# Altium project iMX6 Rex Development Baseboard V1I1.PrjPcb (part 1 of 5)
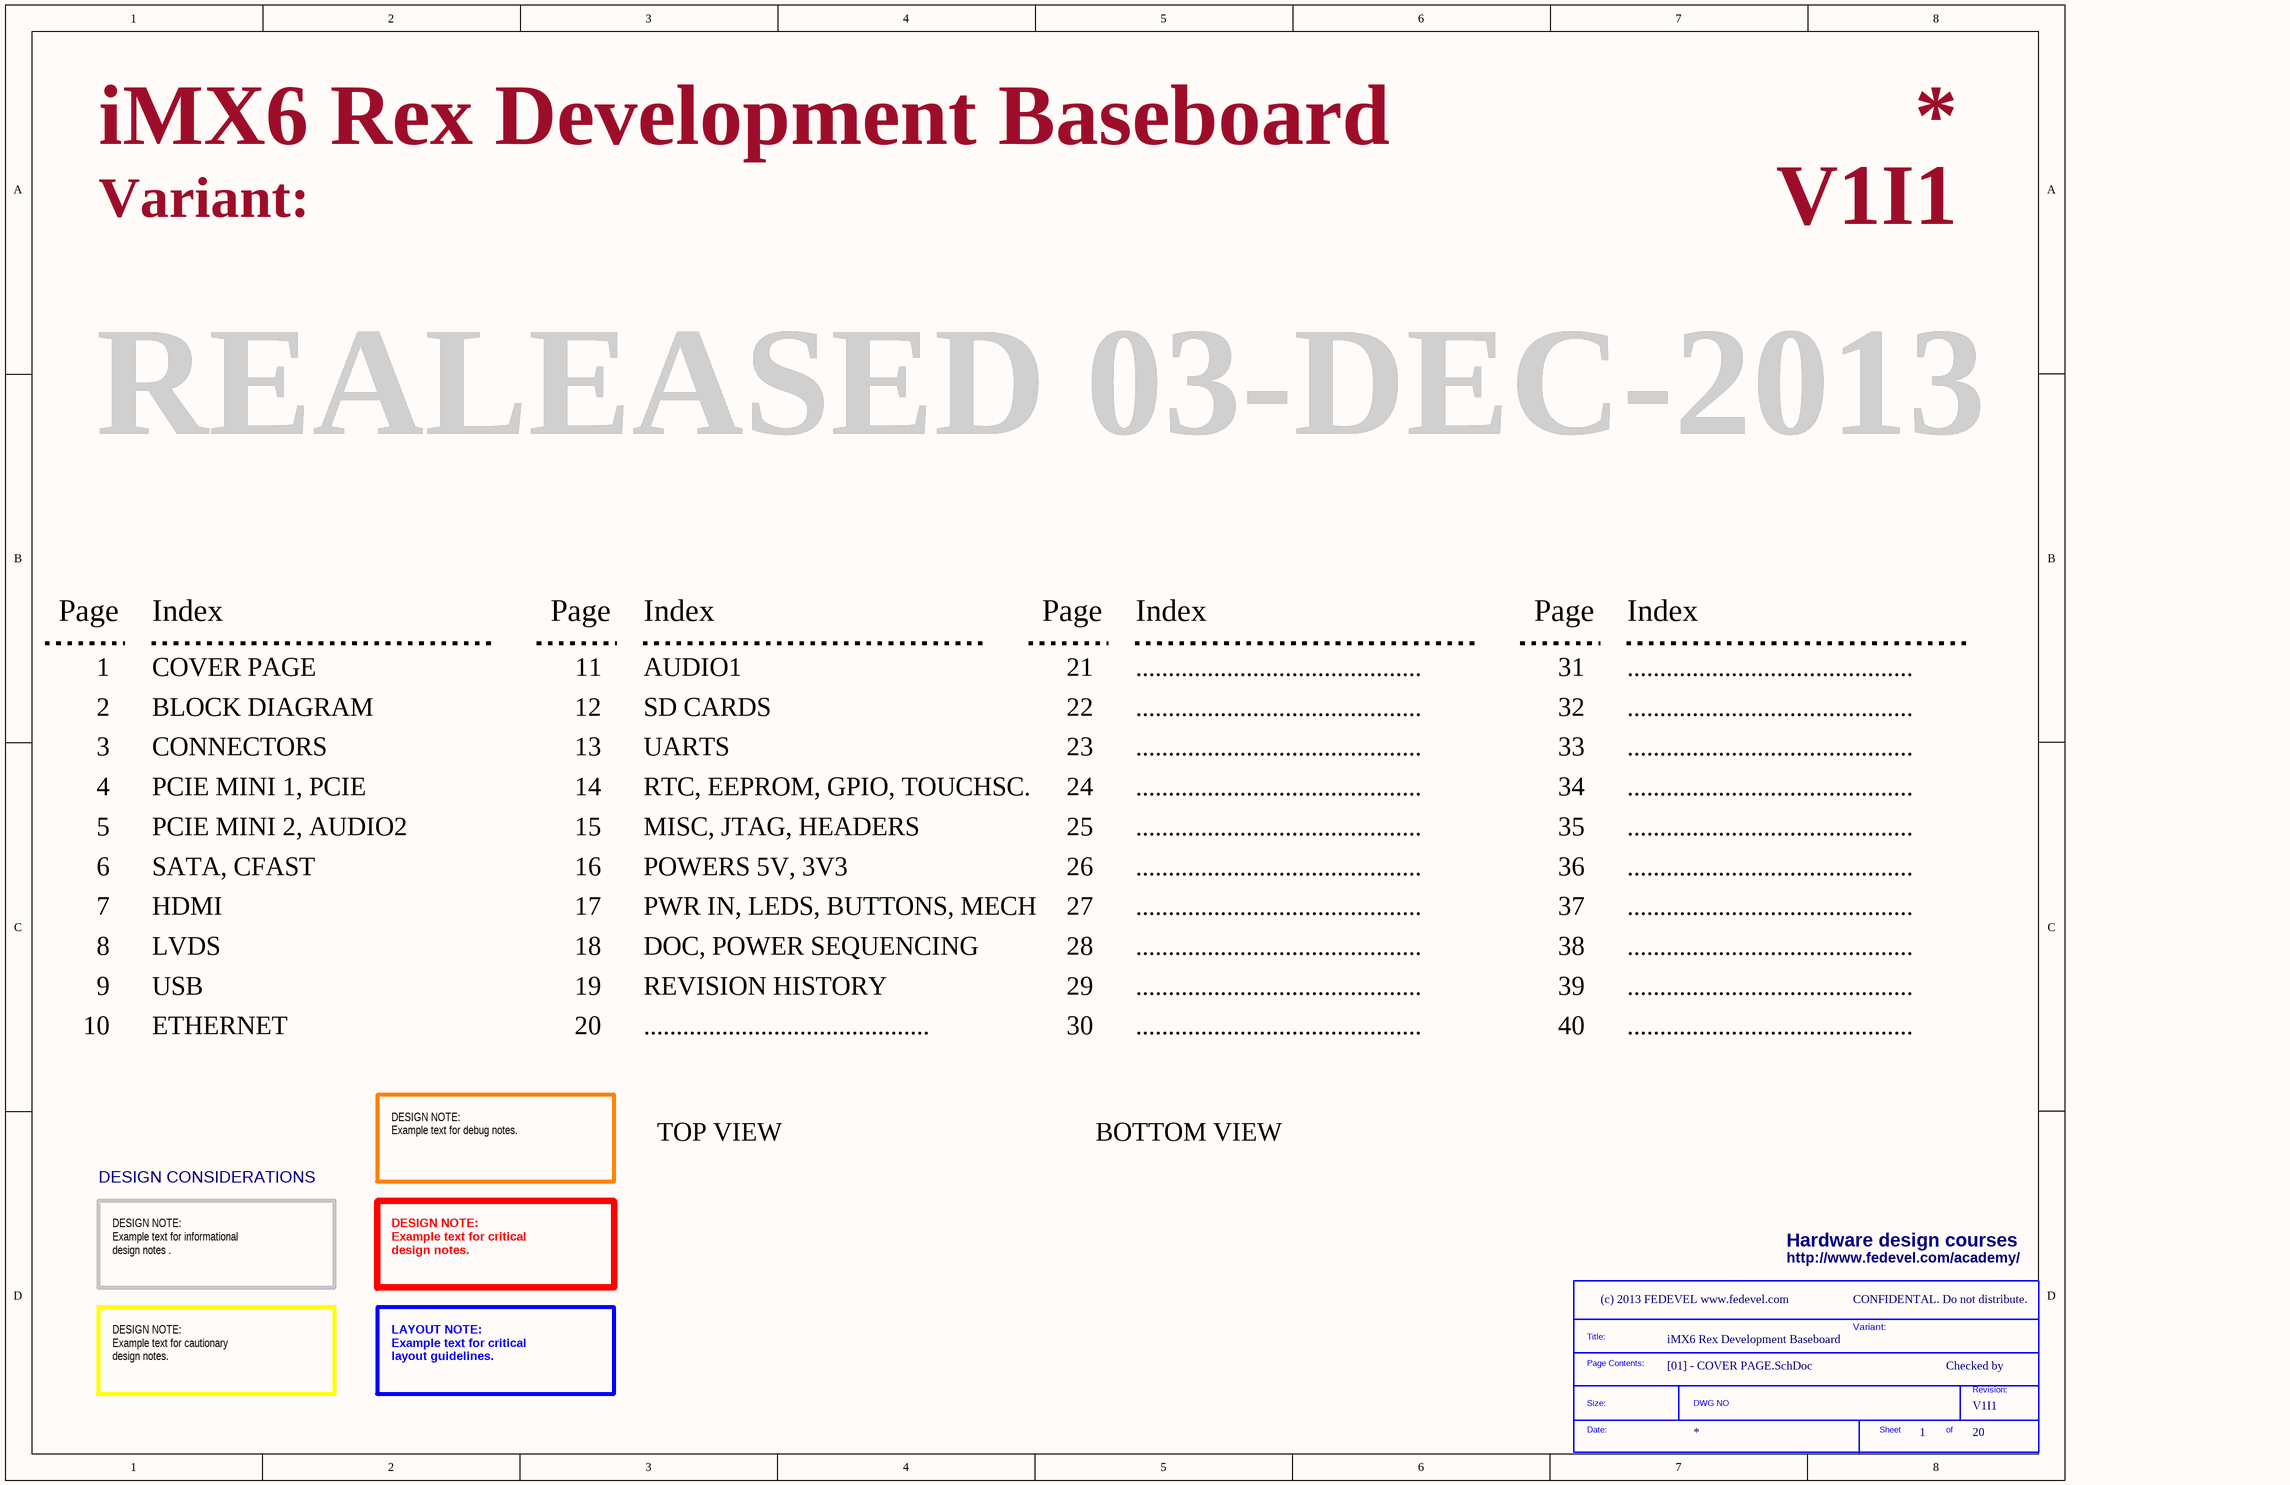
[diagram p0: [01] - COVER PAGE.SchDoc]
ClientCompanyName: FEDEVEL Academy; ClientContactEmail: robert.feranec@fedevel.com; ClientContactName: Robert Feranec; ClientWebsite: http://www.fedevel.com/academy/; Company: (c) 2013 FEDEVEL www.fedevel.com; Project: iMX6 Rex Development Baseboard; VersionRevision: V1I1
11 sheets, 384 parts. Net scope: flat (ports and power ports of the same name join across sheets).
Board file: iMX6 Rex Development Baseboard V1I1_PCB.PcbDoc
Sheets:
  [01] - COVER PAGE.SchDoc
  [04] - PCIE MINI 1, PCIE.SchDoc
  [06] - SATA, CFAST.SchDoc
  [09] - USB.SchDoc
  [10] - ETHERNET.SchDoc
  [11] - AUDIO1.SchDoc
  [12] - SD.SchDoc
  [14] - RTC, EEPROM, GPIO, TOUCH SCREEN.SchDoc
  [16] - POWERS 5V, 3V3.SchDoc
  [17] - PWR IN, LEDS, BUTTONS, MECH.SchDoc
  [19] - REVISION HISTORY.SchDoc

## Sheet [01] - COVER PAGE.SchDoc
size A3; DocumentNumber: 1; SheetNumber: 1; SheetTotal: 20

### Parts
(Parts that share a designator on the sheet are numbered #1, #2 ... from top to bottom, then left to right.)
*#1  SDTitleBlock  (value not drawn)  (graphical)

### Notes on the sheet
- Variant:
- REALEASED 03-DEC-2013
- Page
- Index
- 1
- COVER PAGE
- 11
- AUDIO1
- 21
- ............................................
- 31
- 2
- 3
- BLOCK DIAGRAM
- CONNECTORS
- 12
- 13
- SD CARDS
- UARTS
- 22
- 23
- 32
- 33
- 4
- 5
- PCIE MINI 1, PCIE
- PCIE MINI 2, AUDIO2
- 14
- 15
- RTC, EEPROM, GPIO, TOUCHSC.
- MISC, JTAG, HEADERS
- 24
- 25
- 34
- 35
- 6
- SATA, CFAST
- 16
- POWERS 5V, 3V3
- 26
- 36
- 7
- 8
- HDMI
- LVDS
- 17
- 18
- PWR IN, LEDS, BUTTONS, MECH
- DOC, POWER SEQUENCING
- 27
- 28
- 37
- 38
- 9
- 10
- USB
- ETHERNET
- 19
- 20
- REVISION HISTORY
- 29
- 30
- 39
- 40
- DESIGN NOTE:
  Example text for debug notes.
- TOP VIEW
- BOTTOM VIEW
- DESIGN CONSIDERATIONS
- Hardware design courses
- DESIGN NOTE:
  Example text for informational
  design notes .
- DESIGN NOTE:
  Example text for critical
  design notes.
- http://www.fedevel.com/academy/
- CONFIDENTAL. Do not distribute.
- Checked by
- DESIGN NOTE:
  Example text for cautionary
  design notes.
- LAYOUT NOTE:
  Example text for critical
  layout guidelines.
- (in symbol SDTitleBlock) Title:; Page Contents:; Revision:; Size:; DWG NO; Date:; Sheet; of

## Sheet [04] - PCIE MINI 1, PCIE.SchDoc
size A2; DocumentNumber: 2; SheetNumber: 4; SheetTotal: 20
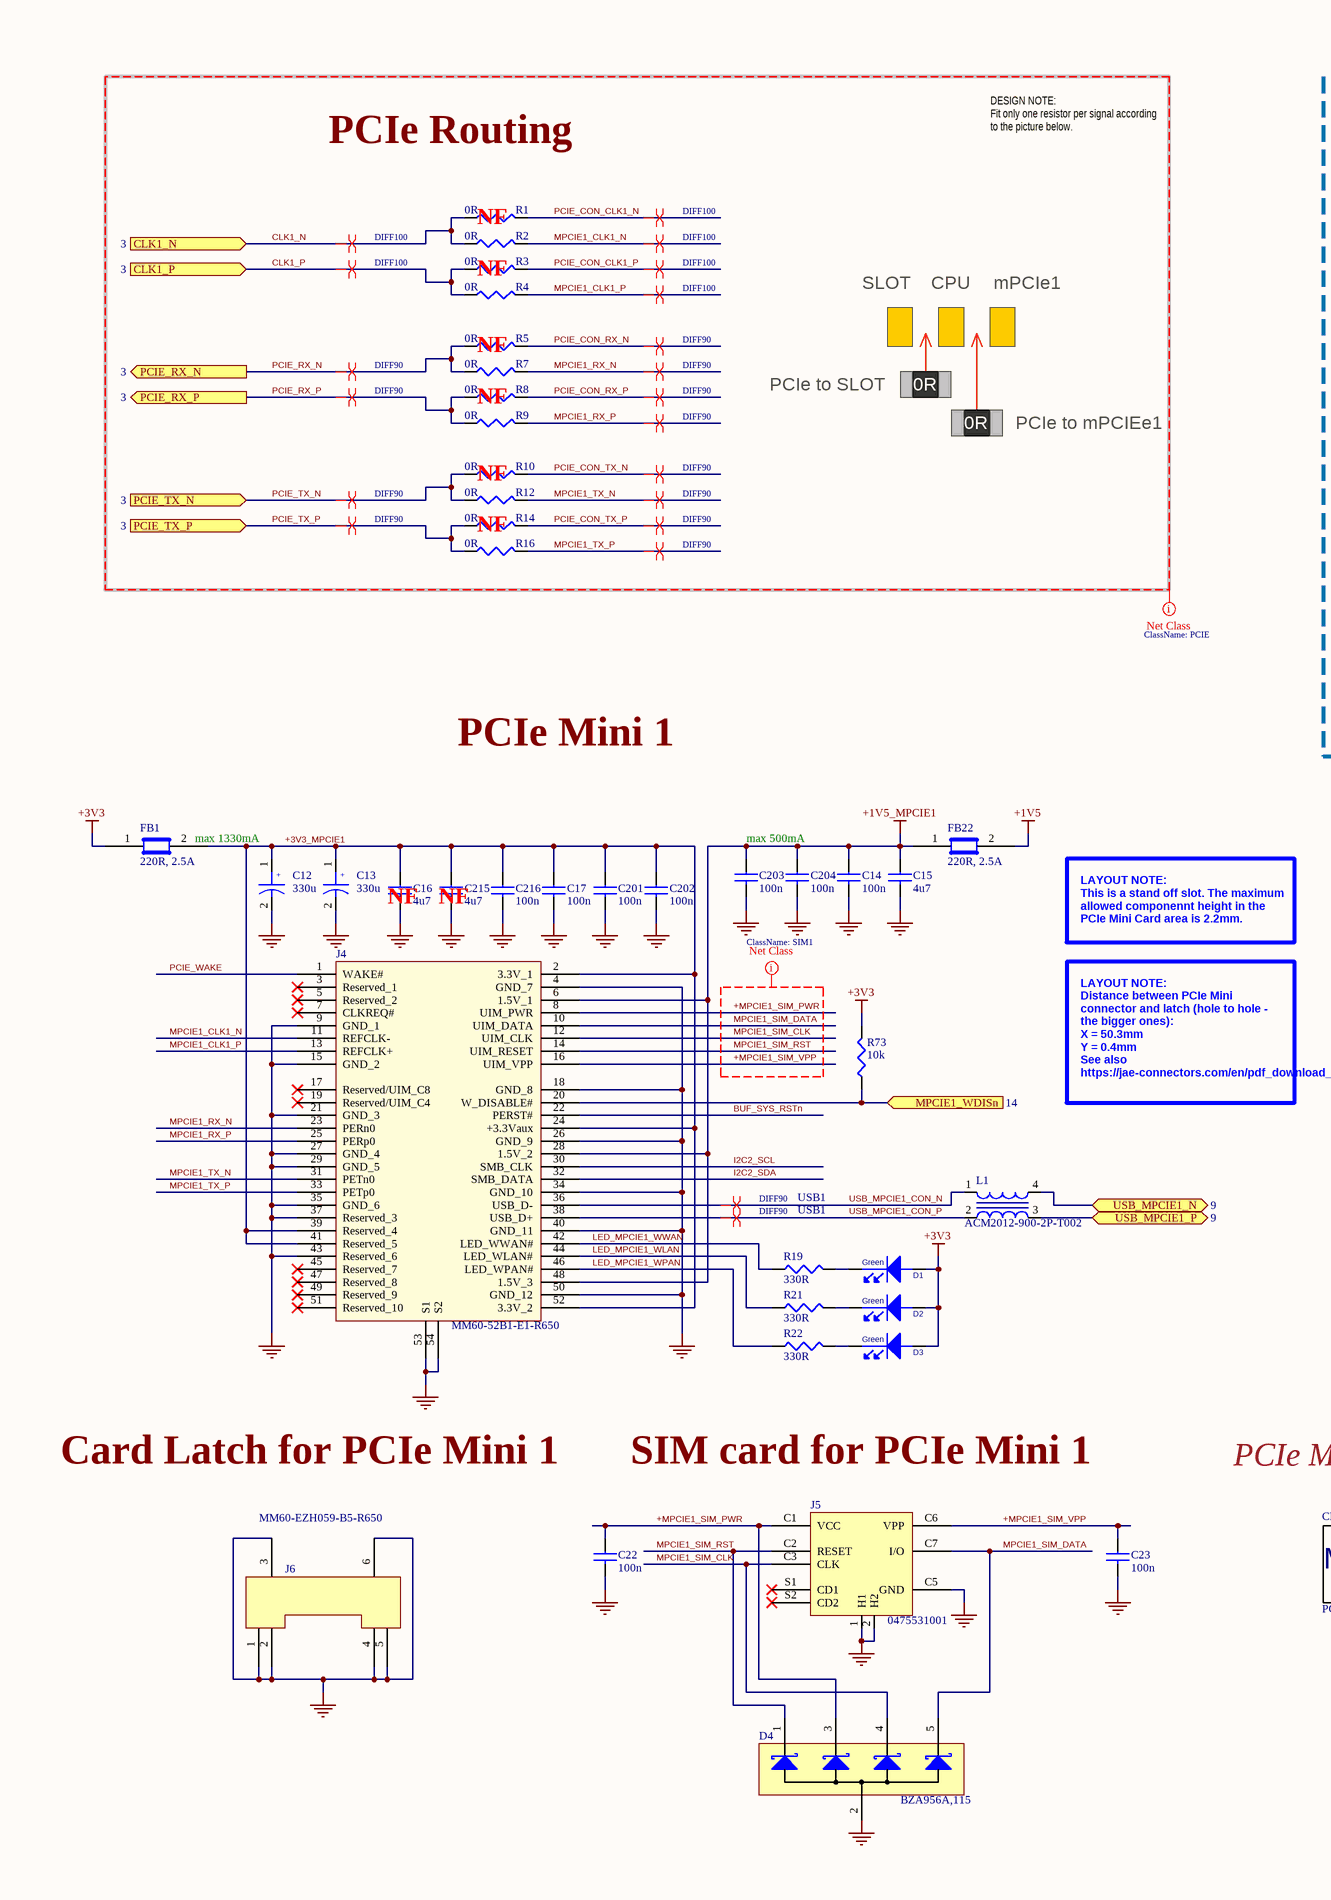
[diagram p1: [04] - PCIE MINI 1, PCIE.SchDoc, left]
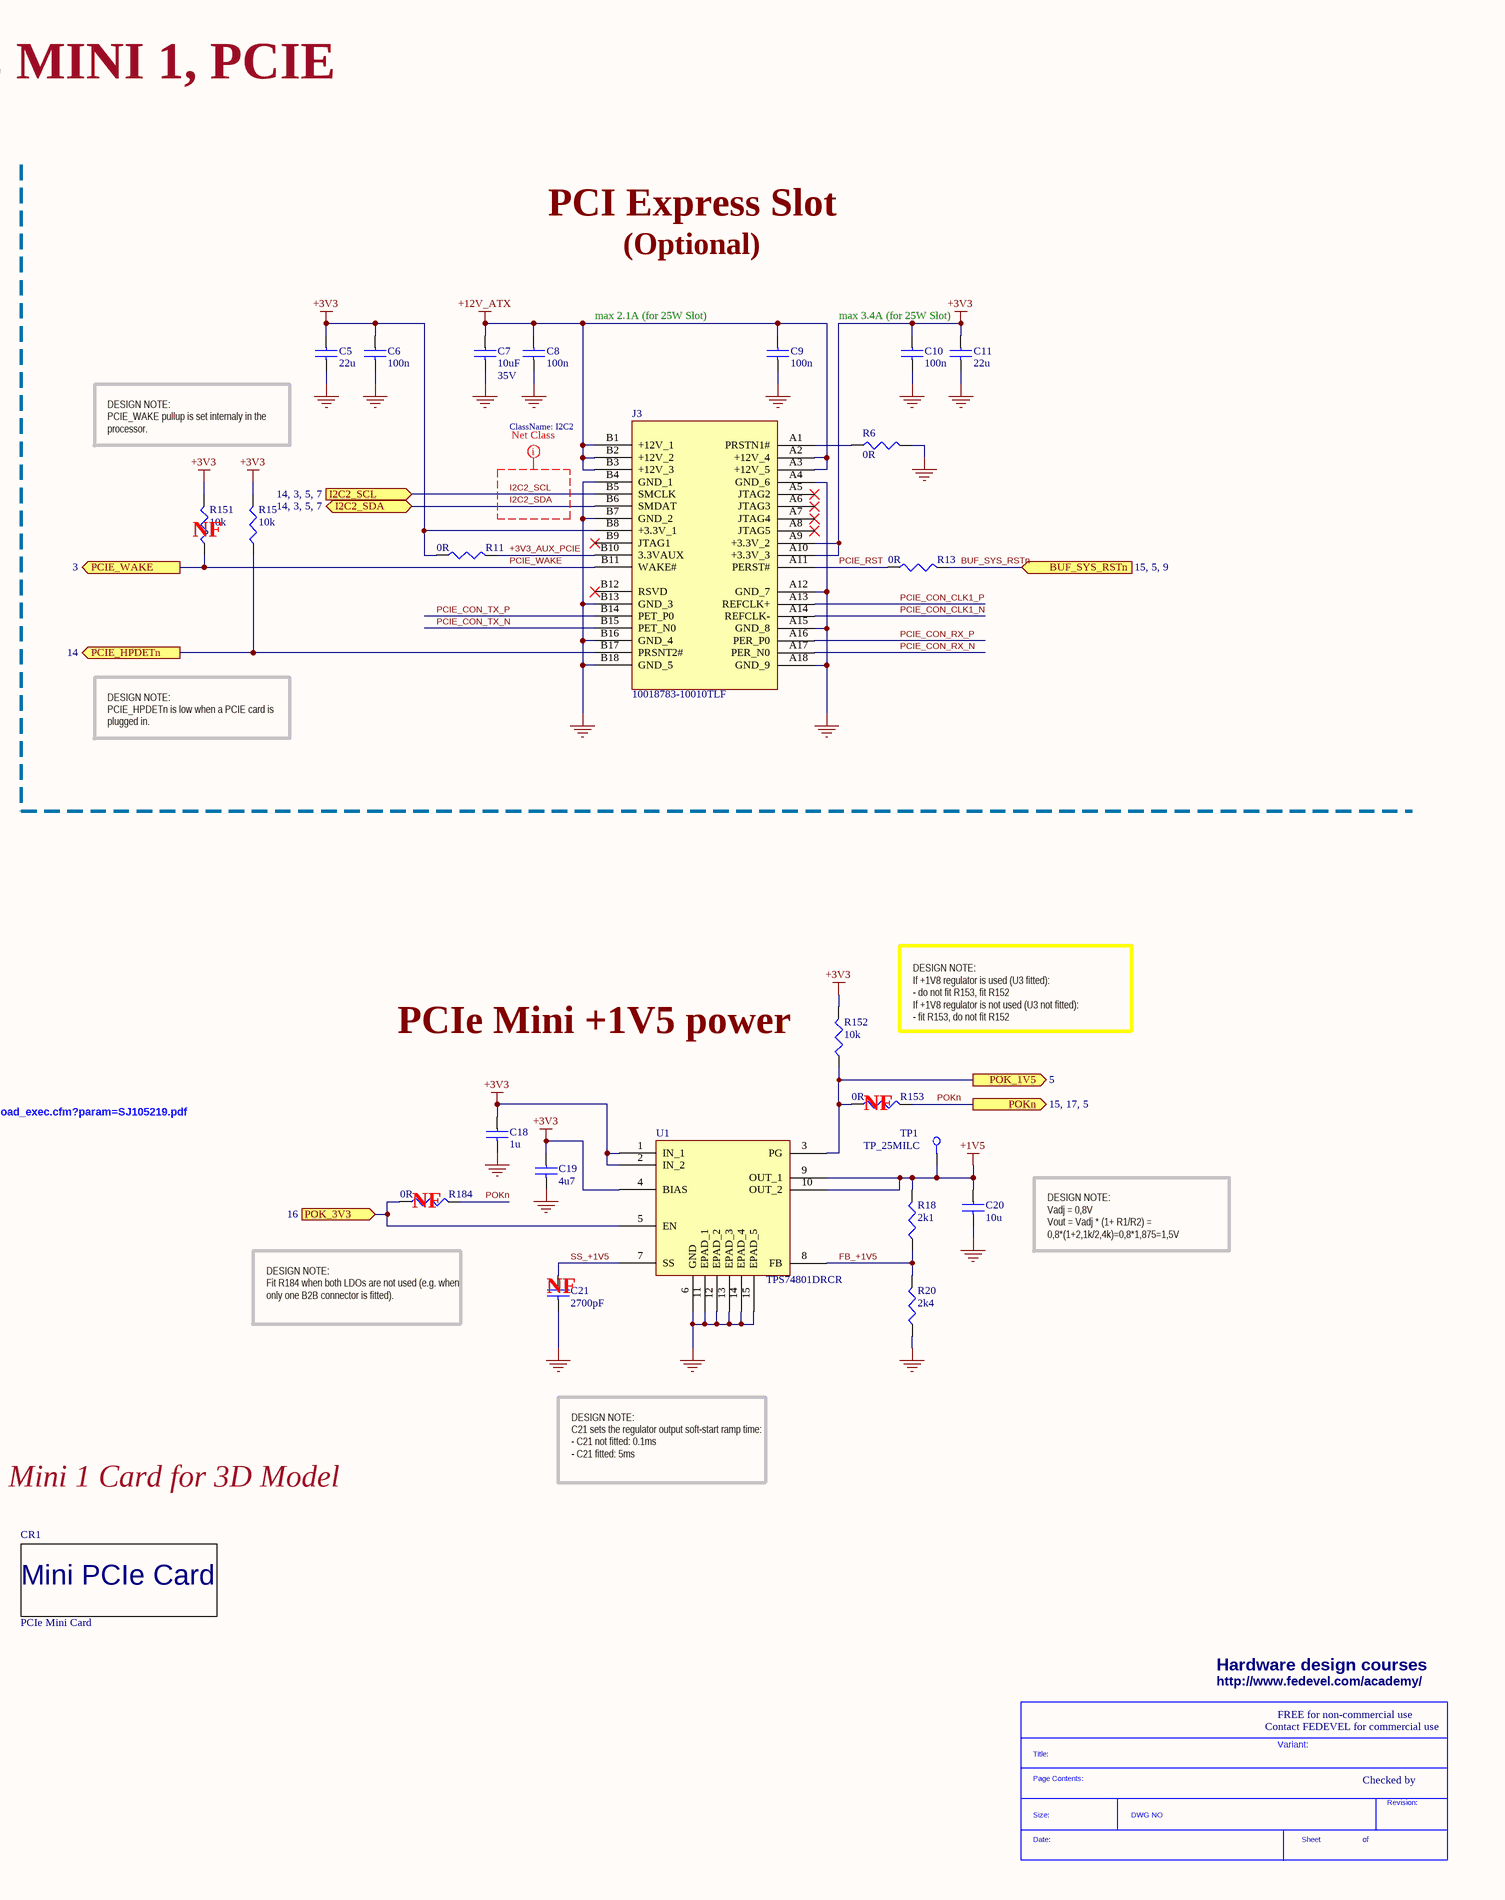
[diagram p2: [04] - PCIE MINI 1, PCIE.SchDoc, right]

### Parts
(Parts that share a designator on the sheet are numbered #1, #2 ... from top to bottom, then left to right.)
*#2  SDTitleBlock  (value not drawn)  (graphical)
C5  22u  [C0805]
C6  100n  [C0402]
C7  10uF  Voltage - Rated: 35V  [C1206]
C8  100n  [C0402]
C9  100n  [C0402]
C10  100n  [C0402]
C11  22u  [C0805]
C12  330u  [C2917]
C13  330u  [C2917]
C14  100n  [C0402]
C15  4u7  [C0402]
C16  4u7  [C0402]
C17  100n  [C0402]
C18  1u  [C0402]
C19  4u7  [C0402]
C20  10u  [C0603]
C21  2700pF  [C0402]
C22  100n  [C0402]
C23  100n  [C0402]
C201  100n  [C0402]
C202  100n  [C0402]
C203  100n  [C0402]
C204  100n  [C0402]
C215  4u7  [C0402]
C216  100n  [C0402]
CR1  PCIe Mini Card  [Mini_PCIe_full card]  (no BOM)
D1  Green  [LED_0603]
D2  Green  [LED_0603]
D3  Green  [LED_0603]
D4  BZA956A,115  [SOT665]
FB1  220R, 2.5A  [C0603]
FB22  220R, 2.5A  [C0603]
J3  10018783-10010TLF  [Mini_PCIe_36pin]
J4  MM60-52B1-E1-R650  [MINI_PCIE_52PIN_CARD_CON]
J5  0475531001  [SIM_CARD_PUSH]
J6  MM60-EZH059-B5-R650  [MINI_PCIE_52PIN_CARD_LATCH]
L1  ACM2012-900-2P-T002  [ACM2012]
R1  0R  [R0402]
R2  0R  [R0402]
R3  0R  [R0402]
R4  0R  [R0402]
R5  0R  [R0402]
R6  0R  [R0402]
R7  0R  [R0402]
R8  0R  [R0402]
R9  0R  [R0402]
R10  0R  [R0402]
R11  0R  [R0402]
R12  0R  [R0402]
R13  0R  [R0402]
R14  0R  [R0402]
R15  10k  [R0402]
R16  0R  [R0402]
R18  2k1  [R0402]
R19  330R  [R0402]
R20  2k4  [R0402]
R21  330R  [R0402]
R22  330R  [R0402]
R73  10k  [R0402]
R151  10k  [R0402]
R152  10k  [R0402]
R153  0R  [R0402]
R184  0R  [R0402]
TP1  TP_25MILC  [TP_25C]  (no BOM)
U1  TPS74801DRCR  [DRC (S-PVSON-N10)]

### Blocks framed on the sheet
PCIe Routing: R1-R5 R7-R10 R12 R14 R16

### Ports
BUF_SYS_RSTn (see 15, 5, 9), CLK1_N (in, see 3), CLK1_P (in, see 3), I2C2_SCL (see 14, 3, 5, 7), I2C2_SDA (bidir, see 14, 3, 5, 7), MPCIE1_WDISn (in, see 14), PCIE_HPDETn (out, see 14), PCIE_RX_N (out, see 3), PCIE_RX_P (out, see 3), PCIE_TX_N (in, see 3), PCIE_TX_P (in, see 3), PCIE_WAKE (out, see 3), POK_1V5 (out, see 5), POK_3V3 (see 16), POKn (see 15, 17, 5), USB_MPCIE1_N (bidir, see 9), USB_MPCIE1_P (bidir, see 9)

### Nets
+1V5: C20.1 FB22.2 R18.2 TP1.1 U1.9(OUT_1) U1.10(OUT_2)
+1V5_MPCIE1: C14.1 C15.1 C203.1 C204.1 FB22.1 J4.6(1.5V_1) J4.28(1.5V_2) J4.48(1.5V_3)
+3V3: C5.1 C6.1 C10.1 C11.1 C18.1 C19.1 D1.2(ANODE) D2.2(ANODE) D3.2(ANODE) FB1.1 J3.A9(+3.3V_2) J3.A10(+3.3V_3) J3.B8(+3.3V_1) R11.1 R15.2 R73.2 R151.2 R152.2 U1.1(IN_1) U1.2(IN_2) U1.4(BIAS)
+12V_ATX: C7.1 C8.1 C9.1 J3.A2(+12V_4) J3.A3(+12V_5) J3.B1(+12V_1) J3.B2(+12V_2) J3.B3(+12V_3)
GND: C5.2 C6.2 C7.2 C8.2 C9.2 C10.2 C11.2 C12.2 C13.2 C14.2 C15.2 C16.2 C17.2 C18.2 C19.2 C20.2 C21.2 C22.2 C23.2 C201.2 C202.2 C203.2 C204.2 C215.2 C216.2 D4.2 J3.A4(GND_6) J3.A12(GND_7) J3.A15(GND_8) J3.A18(GND_9) J3.B4(GND_1) J3.B7(GND_2) J3.B13(GND_3) J3.B16(GND_4) J3.B18(GND_5) J4.4(GND_7) J4.9(GND_1) J4.15(GND_2) J4.18(GND_8) J4.21(GND_3) J4.26(GND_9) J4.27(GND_4) J4.29(GND_5) J4.34(GND_10) J4.35(GND_6) J4.37(Reserved_3) J4.40(GND_11) J4.43(Reserved_6) J4.50(GND_12) J4.53(S1) J4.54(S2) J5.1(H1) J5.2(H2) J5.C5(GND) J6.1 J6.2 J6.3 J6.4 J6.5 J6.6 R6.2 R20.1 U1.6(GND) U1.11(EPAD_1) U1.12(EPAD_2) U1.13(EPAD_3) U1.14(EPAD_4) U1.15(EPAD_5)
+3V3_AUX_PCIE: J3.B10(3.3VAUX) R11.2
+3V3_MPCIE1: C12.1 C13.1 C16.1 C17.1 C201.1 C202.1 C215.1 C216.1 FB1.2 J4.2(3.3V_1) J4.24(+3.3Vaux) J4.39(Reserved_4) J4.41(Reserved_5) J4.52(3.3V_2)
+MPCIE1_SIM_PWR: C22.1 D4.3 J4.8(UIM_PWR) J5.C1(VCC)
+MPCIE1_SIM_VPP: C23.1 J4.16(UIM_VPP) J5.C6(VPP)
BUF_SYS_RSTn: J4.22(PERST#) R13.2 ; port BUF_SYS_RSTn
CLK1_N: R1.1 R2.1 ; port CLK1_N
CLK1_P: R3.1 R4.1 ; port CLK1_P
FB_+1V5: R18.1 R20.2 U1.8(FB)
I2C2_SCL: J3.B5(SMCLK) J4.30(SMB_CLK) ; port I2C2_SCL
I2C2_SDA: J3.B6(SMDAT) J4.32(SMB_DATA) ; port I2C2_SDA
LED_MPCIE1_WLAN: J4.44(LED_WLAN#) R21.1
LED_MPCIE1_WPAN: J4.46(LED_WPAN#) R22.1
LED_MPCIE1_WWAN: J4.42(LED_WWAN#) R19.1
MPCIE1_CLK1_N: J4.11(REFCLK-) R2.2
MPCIE1_CLK1_P: J4.13(REFCLK+) R4.2
MPCIE1_RX_N: J4.23(PERn0) R7.2
MPCIE1_RX_P: J4.25(PERp0) R9.2
MPCIE1_SIM_CLK: D4.4 J4.12(UIM_CLK) J5.C3(CLK)
MPCIE1_SIM_DATA: D4.5 J4.10(UIM_DATA) J5.C7(I/O)
MPCIE1_SIM_RST: D4.1 J4.14(UIM_RESET) J5.C2(RESET)
MPCIE1_TX_N: J4.31(PETn0) R12.2
MPCIE1_TX_P: J4.33(PETp0) R16.2
MPCIE1_WDISn: J4.20(W_DISABLE#) R73.1 ; port MPCIE1_WDISn
PCIE_CON_CLK1_N: J3.A14(REFCLK-) R1.2
PCIE_CON_CLK1_P: J3.A13(REFCLK+) R3.2
PCIE_CON_RX_N: J3.A17(PER_N0) R5.2
PCIE_CON_RX_P: J3.A16(PER_P0) R8.2
PCIE_CON_TX_N: J3.B15(PET_N0) R10.2
PCIE_CON_TX_P: J3.B14(PET_P0) R14.2
PCIE_HPDETn: J3.B17(PRSNT2#) R15.1 ; port PCIE_HPDETn
PCIE_RST: J3.A11(PERST#) R13.1
PCIE_RX_N: R5.1 R7.1 ; port PCIE_RX_N
PCIE_RX_P: R8.1 R9.1 ; port PCIE_RX_P
PCIE_TX_N: R10.1 R12.1 ; port PCIE_TX_N
PCIE_TX_P: R14.1 R16.1 ; port PCIE_TX_P
PCIE_WAKE: J3.B11(WAKE#) J4.1(WAKE#) R151.1 ; port PCIE_WAKE
POK_1V5: R152.1 R153.1 U1.3(PG) ; port POK_1V5
POK_3V3: R184.1 U1.5(EN) ; port POK_3V3
POKn: R153.2 R184.2 ; port POKn
SS_+1V5: C21.1 U1.7(SS)
USB_MPCIE1_CON_N: J4.36(USB_D-) L1.1
USB_MPCIE1_CON_P: J4.38(USB_D+) L1.2
USB_MPCIE1_N: L1.4 ; port USB_MPCIE1_N
USB_MPCIE1_P: L1.3 ; port USB_MPCIE1_P
NetD1_1: D1.1(cathode) R19.2
NetD2_1: D2.1(cathode) R21.2
NetD3_1: D3.1(cathode) R22.2
NetJ3_A1: J3.A1(PRSTN1#) R6.1

Not connected (* = marked no-connect by the designer): J3 A5(JTAG2)* A6(JTAG3)* A7(JTAG4)* A8(JTAG5)* B9(JTAG1)* B12(RSVD)*; J4 3(Reserved_1)* 5(Reserved_2)* 7(CLKREQ#)* 17(Reserved/UIM_C8)* 19(Reserved/UIM_C4)* 45(Reserved_7)* 47(Reserved_8)* 49(Reserved_9)* 51(Reserved_10)*; J5 S1(CD1)* S2(CD2)*

### Layout directives
differential pair; net class DIFF100: CLK1_N, CLK1_P, MPCIE1_CLK1_N, MPCIE1_CLK1_P, PCIE_CON_CLK1_N, PCIE_CON_CLK1_P
differential pair; net class DIFF90: MPCIE1_RX_N, MPCIE1_RX_P, MPCIE1_TX_N, MPCIE1_TX_P, PCIE_CON_RX_N, PCIE_CON_RX_P, PCIE_CON_TX_N, PCIE_CON_TX_P, PCIE_RX_N, PCIE_RX_P, PCIE_TX_N, PCIE_TX_P
net class PCIE: CLK1_N, CLK1_P, MPCIE1_CLK1_N, MPCIE1_CLK1_P, MPCIE1_RX_N, MPCIE1_RX_P, MPCIE1_TX_N, MPCIE1_TX_P, PCIE_CON_CLK1_N, PCIE_CON_CLK1_P, PCIE_CON_RX_N, PCIE_CON_RX_P, PCIE_CON_TX_N, PCIE_CON_TX_P, PCIE_RX_N, PCIE_RX_P, PCIE_TX_N, PCIE_TX_P
net class SIM1: +MPCIE1_SIM_PWR, +MPCIE1_SIM_VPP, MPCIE1_SIM_CLK, MPCIE1_SIM_DATA, MPCIE1_SIM_RST
differential pair; net class DIFF90; net class USB1: USB_MPCIE1_CON_N, USB_MPCIE1_CON_P
net class I2C2: I2C2_SCL, I2C2_SDA

### Notes on the sheet
- PCIE MINI 1, PCIE
- DESIGN NOTE:
  Fit only one resistor per signal according to the picture below.
- PCI Express Slot
- (Optional)
- (near R1) NF
- max 2.1A (for 25W Slot)
- max 3.4A (for 25W Slot)
- (near R3) NF
- SLOT
- CPU
- mPCIe1
- (near R5) NF
- PCIe to SLOT
- 0R
- DESIGN NOTE:
  PCIE_WAKE pullup is set internaly in the processor.
- (near R8) NF
- PCIe to mPCIEe1
- (near R10) NF
- (near R151) NF
- (near R14) NF
- DESIGN NOTE:
  PCIE_HPDETn is low when a PCIE card is plugged in.
- PCIe Mini 1
- max 1330mA
- max 500mA
- (near C16) NF
- (near C215) NF
- LAYOUT NOTE:
  This is a stand off slot. The maximum allowed componennt height in the PCIe Mini Card area is 2.2mm.
- (near R152) PCIe Mini +1V5 power
- DESIGN NOTE:
  If +1V8 regulator is used (U3 fitted):
  - do not fit R153, fit R152
  If +1V8 regulator is not used (U3 not fitted):
  - fit R153, do not fit R152
- LAYOUT NOTE:
  Distance between PCIe Mini connector and latch (hole to hole - the bigger ones):
  X = 50.3mm
  Y = 0.4mm
  See also https://jae-connectors.com/en/pdf_download_exec.cfm?param=SJ105219.pdf
- (near R153) NF
- (near R184) NF
- DESIGN NOTE:
  Vadj = 0,8V
  Vout = Vadj * (1+ R1/R2) = 0,8*(1+2,1k/2,4k)=0,8*1,875=1,5V
- (near C21) NF
- DESIGN NOTE:
  Fit R184 when both LDOs are not used (e.g. when only one B2B connector is fitted).
- Card Latch for PCIe Mini 1
- SIM card for PCIe Mini 1
- PCIe Mini 1 Card for 3D Model
- DESIGN NOTE:
  C21 sets the regulator output soft-start ramp time:
  - C21 not fitted: 0.1ms
  - C21 fitted: 5ms
- Hardware design courses
- http://www.fedevel.com/academy/
- Contact FEDEVEL for commercial use
- FREE for non-commercial use
- Variant:
- Checked by
- (in symbol Card_Mini_PCIe) Mini PCIe Card
- (in symbol SDTitleBlock) Title:; Page Contents:; Revision:; Size:; DWG NO; Date:; Sheet; of
- (in symbol T520D337M006ATE045) +

### Library data of the parts
C5 C11 = C2012X5R1C226K: CAP CER 22UF 16V 10% X5R 0805; Manufacturer: TDK Corporation; Capacitance: 22µF; .Checked PCB: RF; Supplier 1: Digi-Key; Supplier Part Number 1: 445-6797-1-ND; Manufacturer Part Number: C2012X5R1C226K; RoHS: RoHS Compliant; Category: Capacitors; Stock 1: 15408; Pricing 1: 1=0.77, 10=0.737, 100=0.3575, 250=0.297, 500=0.2695, 1000=0.2475 (USD); Voltage - Rated: 16V; Tolerance: ±10%; Temperature Coefficient: X5R; Mounting Type: Surface Mount, MLCC; Operating Temperature: -55°C ~ 85°C; Applications: General Purpose; Ratings: -; Package / Case: 0805 (2012 Metric); Size / Dimension: 0.079" L x 0.049" W (2.00mm x 1.25mm); Height - Seated (Max): -; Thickness (Max): 0.057" (1.45mm); Lead Spacing: -; Features: -; Packaging: Cut Tape (CT); Lead Style: -; ComponentLink1URL: http://www.tdk.com/pdf/general_B11.pdf; ComponentLink1Description: http://www.tdk.com/pdf/general_B11.pdf; .Checked SCH: RF
C6 C8-C10 C14 C17 C22 C23 C201-C204 C216 = C1005X5R1H104K: CAP CER .10UF 50V X5R 10% 0402; Manufacturer: TDK Corporation; Capacitance: 0.1µF; Value: 100nF; .Checked PCB: used; Description: CAP CER 0.1UF 50V 10% X5R 0402; Category: Capacitors; Supplier Part Number: 445-5942-1-ND; Manufacturer Part Number: C1005X5R1H104K; Operating Temperature: -55°C ~ 85°C; Package / Case: 0402 (1005 Metric); Price 1k [$]: 0.02340; .Checked SCH: used; Voltage - Rated: 50V; Supplier: Digikey; Supplier 1: Digi-Key; Supplier Part Number 1: 445-5942-1-ND; RoHS: RoHS Compliant; Stock 1: 106926; Pricing 1: 1=0.27, 10=0.18, 100=0.072, 250=0.05176, 500=0.0369, 1000=0.027 (USD); Tolerance: ±10%; Temperature Coefficient: X5R; Mounting Type: Surface Mount, MLCC; Applications: General Purpose; Ratings: -; Size / Dimension: 0.039" L x 0.020" W (1.00mm x 0.50mm); Height - Seated (Max): -; Thickness (Max): 0.022" (0.55mm); Lead Spacing: -; Features: -; Packaging: Cut Tape (CT); Lead Style: -; ComponentLink1URL: http://www.tdk.co.jp/tefe02/e412_c.pdf; ComponentLink1Description: http://www.tdk.co.jp/tefe02/e412_c.pdf
C7 = GRM31CR6YA106KA12L: CAP CER 10UF 35V X5R 1206; Manufacturer: Murata Electronics North America; Capacitance: 10µF; .Checked PCB: used; Description: CAP CER 10UF 35V 10% X5R 1206; Tolerance: ±10%; Category: Capacitors; Supplier Part Number: 490-5524-1-ND; Manufacturer Part Number: GRM31CR6YA106KA12L; Operating Temperature: -55°C ~ 85°C; Package / Case: 1206 (3216 Metric); Price 1k [$]: 0.19448; Value: 10uF; .Checked SCH: used; Supplier: Digikey; Supplier 1: Digi-Key; Supplier Part Number 1: 490-5524-1-ND; RoHS: RoHS Compliant; Stock 1: 76334; Pricing 1: 1=0.6, 10=0.501, 50=0.359, 100=0.3142, 250=0.24684, 500=0.2244, 1000=0.17952 (USD); Temperature Coefficient: X5R; Mounting Type: Surface Mount, MLCC; Applications: General Purpose; Ratings: -; Size / Dimension: 0.126" L x 0.063" W (3.20mm x 1.60mm); Height - Seated (Max): -; Thickness (Max): 0.071" (1.80mm); Lead Spacing: -; Features: -; Packaging: Cut Tape (CT); Lead Style: -; ComponentLink1URL: http://www.murata.com/products/catalog/pdf/c02e.pdf; ComponentLink1Description: http://www.murata.com/products/catalog/pdf/c02e.pdf
C12 C13 = T520D337M006ATE045: CAP TANT 330UF 6.3V 20% 2917; Manufacturer: Kemet; Manufacturer Size Code: D; Capacitance: 330µF; ESR (Equivalent Series Resistance): 45 mOhm; Type: Molded; .Creator: MM; .Checked SCH: RF, used by MM; Supplier 1: Digi-Key; Manufacturer Part Number: T520D337M006ATE045; RoHS: RoHS Compliant; Category: Capacitors; Stock 1: 11758; Pricing 1: 1=1.33, 10=1.05, 50=0.91, 100=0.7875, 250=0.7 (USD); Packaging: Cut Tape (CT); Voltage - Rated: 6.3V; Tolerance: ±20%; Operating Temperature: -55°C ~ 105°C; Mounting Type: Surface Mount; Package / Case: 2917 (7343 Metric); Size / Dimension: 0.287" L x 0.169" W (7.30mm x 4.30mm); Height - Seated (Max): 0.122" (3.10mm); Lead Spacing: -; Features: Polymer; Lifetime @ Temp.: -; ComponentLink1URL: http://www.kemet.com/kemet/web/homepage/kechome.nsf/file/T520%20Series/$file/KEM_T2015_T520.pdf; ComponentLink1Description: http://www.kemet.com/kemet/web/homepage/kechome.nsf/file/T520%20Series/$file/KEM_T2015_T520.pdf; Supplier Part Number 1: 399-4055-1-ND; .Checked PCB: MM
C15 C16 C19 C215 = C1005X5R1A475M: CAP CER 4.7UF 10V 20% X5R 0402; Manufacturer: TDK Corporation; Capacitance: 4.7µF; .Checked PCB: RF; Supplier 1: Digi-Key; Supplier Part Number 1: 445-8023-1-ND; Manufacturer Part Number: C1005X5R1A475M; RoHS: RoHS Compliant; Category: Capacitors; Stock 1: 10140; Pricing 1: 1=0.53, 10=0.415, 100=0.25, 250=0.18752, 500=0.16, 1000=0.125, 5000=0.095 (USD); Voltage - Rated: 10V; Tolerance: ±20%; Temperature Coefficient: X5R; Mounting Type: Surface Mount, MLCC; Operating Temperature: -55°C ~ 85°C; Applications: General Purpose; Ratings: -; Package / Case: 0402 (1005 Metric); Size / Dimension: 0.039" L x 0.020" W (1.00mm x 0.50mm); Height - Seated (Max): -; Thickness (Max): -; Lead Spacing: -; Features: -; Packaging: Cut Tape (CT); Lead Style: -; ComponentLink1URL: http://www.tdk.com/pdf/general_B11.pdf; ComponentLink1Description: http://www.tdk.com/pdf/general_B11.pdf; .Checked SCH: RF
C18 = C1005X5R1C105K: CAP CER 1.0UF 16V X5R 0402; Manufacturer: TDK Corporation; Capacitance: 1.0µF; Value: 1uF; .Checked PCB: used; Description: CAP CER 1UF 16V 10% X5R 0402; Tolerance: ±10%; Category: Capacitors; Supplier Part Number: 445-4978-1-ND; Manufacturer Part Number: C1005X5R1C105K; Operating Temperature: -55°C ~ 85°C; Package / Case: 0402 (1005 Metric); Price 1k [$]: 0.02080; .Checked SCH: used; Voltage - Rated: 16V; Supplier: Digikey; Supplier 1: Digi-Key; Supplier Part Number 1: 445-4978-1-ND; RoHS: RoHS Compliant; Stock 1: 341010; Pricing 1: 1=0.24, 10=0.16, 100=0.064, 250=0.046, 500=0.0328, 1000=0.024 (USD); Temperature Coefficient: X5R; Mounting Type: Surface Mount, MLCC; Applications: General Purpose; Ratings: -; Size / Dimension: 0.039" L x 0.020" W (1.00mm x 0.50mm); Height - Seated (Max): -; Thickness (Max): 0.022" (0.55mm); Lead Spacing: -; Features: -; Packaging: Cut Tape (CT); Lead Style: -; ComponentLink1URL: http://www.tdk.co.jp/tefe02/e412_c.pdf; ComponentLink1Description: http://www.tdk.co.jp/tefe02/e412_c.pdf
C20 = C1608X5R0J106M: CAP CER 10UF 6.3V X5R 20% 0603; Manufacturer: TDK Corporation; Capacitance: 10µF; Value: 10µF; .Checked PCB: used; Description: CAP CER 10UF 6.3V 20% X5R 0603; Category: Capacitors; Supplier Part Number: 445-4112-1-ND; Manufacturer Part Number: C1608X5R0J106M; Operating Temperature: -55°C ~ 85°C; Package / Case: 0603 (1608 Metric); Price 1k [$]: 0.08580; .Checked SCH: used; Voltage - Rated: 6.3V; Features: Low ESR; Supplier: Digikey; Supplier 1: Digi-Key; Supplier Part Number 1: 445-4112-1-ND; RoHS: RoHS Compliant; Stock 1: 48157; Pricing 1: 1=0.46, 10=0.363, 100=0.1898, 250=0.14024, 500=0.1089, 1000=0.0858 (USD); Tolerance: ±20%; Temperature Coefficient: X5R; Mounting Type: Surface Mount, MLCC; Applications: General Purpose; Ratings: -; Size / Dimension: 0.063" L x 0.031" W (1.60mm x 0.80mm); Height - Seated (Max): -; Thickness (Max): 0.037" (0.95mm); Lead Spacing: -; Packaging: Cut Tape (CT); Lead Style: -; ComponentLink1URL: http://www.tdk.com/pdf/general_B11.pdf; ComponentLink1Description: http://www.tdk.com/pdf/general_B11.pdf
C21 = GRM155R71H272KA01D: CAP CER 2700PF 50V 10% X7R 0402; Manufacturer: Murata Electronics North America; .Checked PCB: RF; Supplier 1: Digi-Key; Supplier Part Number 1: 490-1306-1-ND; Manufacturer Part Number: GRM155R71H272KA01D; RoHS: RoHS Compliant; Category: Capacitors; Stock 1: 38160; Pricing 1: 10=0.01, 50=0.0086, 100=0.0074, 250=0.00664, 500=0.00618, 750=0.00571, 1000=0.00542 (USD); Capacitance: 2700pF; Voltage - Rated: 50V; Tolerance: ±10%; Temperature Coefficient: X7R; Mounting Type: Surface Mount, MLCC; Operating Temperature: -55°C ~ 125°C; Applications: General Purpose; Ratings: -; Package / Case: 0402 (1005 Metric); Size / Dimension: 0.039" L x 0.020" W (1.00mm x 0.50mm); Height - Seated (Max): -; Thickness (Max): 0.022" (0.55mm); Lead Spacing: -; Features: -; Packaging: Cut Tape (CT); Lead Style: -; ComponentLink1URL: http://search.murata.co.jp/Ceramy/image/img/PDF/ENG/GRM155R71H272KA01.pdf; ComponentLink1Description: http://search.murata.co.jp/Ceramy/image/img/PDF/ENG/GRM155R71H272KA01.pdf; .Checked SCH: RF
CR1 = Card_Mini_PCIe: Card MIni PCIe; .Creator: MM; Category: Card
D1-D3 = LG L29K-G2J1-24-Z: LED SMARTLED GREEN 570NM 0603; Manufacturer: OSRAM Opto Semiconductors Inc; .Checked PCB: used; Current - Test: 2mA; Voltage - Forward (Vf) Typ: 1.7V; Luminous Flux @ Current - Test: 12 mlm; Millicandela Rating: 3.92mcd; Wavelength - Peak: 572nm; Lens Type: Diffused; Lens Style/Size: Rectangle with Flat Top, 1.3mm x 0.8mm; Viewing Angle: 160°; Regulator Topology: Positive Fixed; Voltage - Output: 2.5V; Voltage - Input: 2.6 V ~ 6 V; Voltage - Dropout (Typical): 0.16V @ 500mA; Number of Regulators: 1; Current - Output: 500mA; Current - Limit (Min): 600mA; .Checked SCH: used; Category: Optoelectronics; Supplier Part Number: 475-2709-1-ND; Family: LEDs - <75mA, Discre; Manufacturer Part Number: LG L29K-G2J1-24-Z; Price 1k [$]: 0.08744; Value: Green; Color: Green; Package / Case: 0603 (1608 Metric); Supplier: Digikey; Supplier 1: Digi-Key; Supplier Part Number 1: 475-2709-1-ND; RoHS: RoHS Compliant; Stock 1: 30318; Pricing 1: 1=0.16, 10=0.137, 100=0.1093, 250=0.09564, 500=0.08744 (USD); Wavelength - Dominant: 570nm; Size / Dimension: 1.70mm L x 0.80mm W; Height: 0.65mm; Mounting Type: Surface Mount; Packaging: Cut Tape (CT); ComponentLink1URL: http://catalog.osram-os.com/catalogue/catalogue.do;jsessionid=32CB61882C089EDD4B6D0A54E7E1F117?act=downloadFile&favOid=020000020000138e000100b6; ComponentLink1Description: http://catalog.osram-os.com/catalogue/catalogue.do;jsessionid=32CB61882C089EDD4B6D0A54E7E1F117?act=downloadFile&favOid=020000020000138e000100b6; Operating Temperature: -40°C ~ 125°C; Supplier Device Package: 6-TMLF® (1.6x1.6); ComponentLink2URL: http://www.micrel.com/_PDF/mic5353.pdf; ComponentLink2Description: http://www.micrel.com/_PDF/mic5353.pdf
D4 = BZA956A,115: TVS ZENER QUAD 5.6V SOT665; Manufacturer: NXP Semiconductors; Voltage - Reverse Standoff (Typ): 3V; Voltage - Breakdown: 5.32V; Power (Watts): 16W; Polarization: 4 Channel Array - Unidirectional; .Creator: MM; Supplier 1: Digi-Key; Manufacturer Part Number: BZA956A,115; RoHS: RoHS Compliant; Category: Circuit Protection; Stock 1: 7740; Pricing 1: 1=0.55, 10=0.386, 25=0.3176, 100=0.2537, 250=0.1848, 500=0.15008, 1000=0.11536 (USD); Packaging: Cut Tape (CT); Mounting Type: Surface Mount; Package / Case: SOT-665; Supplier Device Package: SOT-665; ComponentLink1URL: http://www.nxp.com/documents/data_sheet/BZA900A_SERIES.pdf; ComponentLink1Description: http://www.nxp.com/documents/data_sheet/BZA900A_SERIES.pdf; Supplier Part Number 1: 568-7016-1-ND; .Checked PCB: MM; .Checked SCH: MM
FB1 FB22 = BLM18SG221TN1D: FERRITE CHIP 220 OHM 2500MA 0603; Manufacturer: Murata Electronics North America; Impedance @ Frequency: 220 Ohm @ 100MHz; DC Resistance (DCR): 40 mOhm Max; Filter Type: Differential Mode - Single; Number of Lines: 1; .Checked PCB: RF; Supplier 1: Digi-Key; Supplier Part Number 1: 490-5225-1-ND; Manufacturer Part Number: BLM18SG221TN1D; RoHS: RoHS Compliant; Category: Filters; Stock 1: 54640; Pricing 1: 1=0.38, 10=0.282, 50=0.1646, 100=0.1316, 250=0.094, 500=0.06392, 1000=0.0517, 5000=0.04042 (USD); Current Rating: 2.5A; Package / Case: 0603 (1608 Metric); Mounting Type: Surface Mount; Packaging: Cut Tape (CT); Height (Max): 0.037" (0.95mm); Size / Dimension: 0.063" L x 0.031" W (1.60mm x 0.80mm); ComponentLink1URL: http://search.murata.co.jp/Ceramy/image/img/PDF/ENG/L0110S0100BLM18S.pdf; ComponentLink1Description: http://search.murata.co.jp/Ceramy/image/img/PDF/ENG/L0110S0100BLM18S.pdf; .Checked SCH: RF
J3 = 10018783-10010TLF: CONN PCI EXPRESS 36POS VERT PCB; Manufacturer 1: FCI; Card Type: PCI Express™; Gender: Female; Number of Positions: 36; Card Thickness: 0.062" (1.57mm); Pitch: 0.039" (1.00mm); Material - Insulation: Polyamide (PA), Nylon, Glass Filled; Read Out: Dual; .Creator: MM; Supplier 1: Digi-Key; RoHS: RoHS Compliant; Category: Connectors, Interconnects; Pricing 1: 1=0.74, 10=0.69, 50=0.552, 100=0.529, 250=0.483, 500=0.46, 1000=0.3795, 2500=0.345, 5000=0.3335 (USD); Packaging: Tray; Number of Positions/Bay/Row: -; Number of Rows: 2; Features: Board Guide, Locking Ramp; Mounting Type: Through Hole; Termination: Solder, Staggered; Contact Material: Copper Alloy; Contact Finish: Gold; Contact Finish Thickness: 30µin (0.76µm); Contact Type: Cantilever; Color: Black; Flange Feature: -; Operating Temperature: -55°C ~ 85°C; ComponentLink1URL: http://portal.fciconnect.com/Comergent//fci/drawing/10018783.pdf; ComponentLink1Description: http://portal.fciconnect.com/Comergent//fci/drawing/10018783.pdf; .Checked PCB: MM; .Checked SCH: MM; Manufacturer Part Number 1: 10018783-10010TLF; Supplier Stock 1: 832; Supplier Part Number 1: 609-1964-ND
J4 = MM60-52B1-E1-R650: CONN MINI EXPRESS CARD 52POS SMD; Manufacturer: JAE Electronics; Card Type: PCI Express Mini Card; Gender: Female; Number of Positions: 52; Card Thickness: 0.039" (1.00mm); Pitch: 0.031" (0.80mm); Material - Insulation: Thermoplastic; Read Out: Dual; .Creator: MM; Supplier 1: Digi-Key; Manufacturer Part Number: MM60-52B1-E1-R650; RoHS: RoHS Compliant; Category: Connectors, Interconnects; Stock 1: 470; Pricing 1: 1=2.16, 10=1.962, 25=1.842, 100=1.6817, 250=1.52152 (USD); Packaging: Cut Tape (CT); Number of Positions/Bay/Row: -; Number of Rows: 2; Features: Board Guide; Mounting Type: Surface Mount, Right Angle; Termination: Solder; Contact Material: Copper Alloy; Contact Finish: Gold; Contact Finish Thickness: 4µin (0.10µm); Contact Type: -; Color: -; Flange Feature: -; Operating Temperature: -40°C ~ 85°C; ComponentLink1URL: http://jae-connectors.com/en/pdf/JACS-10313_MM60.pdf; ComponentLink1Description: http://jae-connectors.com/en/pdf/JACS-10313_MM60.pdf; Supplier Part Number 1: 670-2275-1-ND; .Checked PCB: MM; .Checked SCH: MM
J5 = 0475531001: CONN CARD HOLDER SIM 6POS SMD; Manufacturer: Molex Inc; Card Type: SIM Card; Number of Positions: 8 (6 + 2); Connector Type: Connector; Insertion, Removal Method: Push In, Push Out; .Creator: MM; Supplier 1: Digi-Key; Manufacturer Part Number: 0475531001; RoHS: RoHS Compliant; Category: Connectors, Interconnects; Stock 1: 8474; Pricing 1: 1=2.94, 10=2.822, 25=2.5868, 50=2.4694, 100=2.3518, 250=2.05784 (USD); Packaging: Cut Tape (CT); Ejector Side: -; Mounting Type: Surface Mount, Right Angle; Features: Switch; Height Above Board: 0.071" (1.80mm); Mounting Feature: Normal, Standard - Top; Contact Finish: Gold; Contact Finish Thickness: 30µin (0.76µm); ComponentLink1URL: http://www.molex.com/pdm_docs/sd/475531001_sd.pdf; ComponentLink1Description: http://www.molex.com/pdm_docs/sd/475531001_sd.pdf; Supplier Part Number 1: WM6739CT-ND; .Checked PCB: MM; .Checked SCH: MM
J6 = MM60-EZH059-B5-R650: CONN MINI EXPRESS CARD LATCH SMD; Manufacturer: JAE Electronics; For Use With/Related Products: PCI Express Mini Card; .Creator: MM; Supplier 1: Digi-Key; Manufacturer Part Number: MM60-EZH059-B5-R650; RoHS: RoHS Compliant; Category: Connectors, Interconnects; Stock 1: 4853; Pricing 1: 1=1.22, 10=1.075, 25=1.0116, 100=0.9272, 250=0.84292 (USD); Packaging: Cut Tape (CT); Accessory Type: Latch; ComponentLink1URL: http://jae-connector.com/en/pdf/SJ105221.pdf; ComponentLink1Description: http://jae-connector.com/en/pdf/SJ105221.pdf; Supplier Part Number 1: 670-2277-1-ND; .Checked PCB: MM; .Checked SCH: MM
L1 = ACM2012-900-2P-T002: CHOKE COMM MODE 90 OHM .4A SMD; Manufacturer: TDK Corporation; Filter Type: Data, Signal Line; Number of Lines: 2; Current: 400mA; DC Resistance (DCR): 190 mOhm Max; Impedance: 90 Ohm; Resistance (Ohms): 8.2K; Power (Watts): 0.063W, 1/16W; Temperature Coefficient: ±100ppm/°C; Tolerance: ±1%; .Checked PCB: RF; Supplier 1: Digi-Key; Supplier Part Number 1: 445-2207-1-ND; Manufacturer Part Number: ACM2012-900-2P-T002; RoHS: RoHS Compliant; Category: Filters; Stock 1: 175768; Pricing 1: 1=0.48, 10=0.448, 50=0.42, 100=0.364, 500=0.308, 1000=0.252 (USD); Inductance: -; Mounting Type: Surface Mount; Size / Dimension: 0.079" L x 0.047" W (2.00mm x 1.20mm); Height (Max): 0.051" (1.30mm); Package / Case: 0805 (2012 Metric), 4 Lead; Operating Temperature: -25°C ~ 85°C; Packaging: Cut Tape (CT); ComponentLink1URL: http://www.tdk.co.jp/tefe02/e9719_acm2012.pdf; ComponentLink1Description: http://www.tdk.co.jp/tefe02/e9719_acm2012.pdf; Composition: Thick Film; Features: -; Height: 0.016" (0.40mm); Number of Terminations: 2; ComponentLink2URL: http://www.yageo.com/documents/recent/PYu-RC0402_51_RoHS_L_6.pdf; ComponentLink2Description: http://www.yageo.com/documents/recent/PYu-RC0402_51_RoHS_L_6.pdf; .Checked SCH: RF
R1-R14 R16 R153 R184 = RC0402JR-070RL: RES 0.0 OHM 1/16W 0402 SMD; Manufacturer: Yageo; Resistance (Ohms): 0.0; Power (Watts): 0.063W, 1/16W; Tolerance: Jumper; .Checked PCB: used; Category: Resistors; Manufacturer Part Number: RC0402JR-070RL; Package / Case: 0402 (1005 Metric); Price 1k [$]: 0.01389; Value: 0R; .Checked SCH: used; Supplier Part Number: 311-0.0JRCT-ND; Supplier: Digikey; Supplier 1: Digi-Key; Supplier Part Number 1: 311-0.0JRCT-ND; RoHS: RoHS Compliant; Stock 1: 1106330; Pricing 1: 10=0.012, 50=0.009, 100=0.0069, 250=0.00512, 500=0.0038, 1000=0.00253 (USD); Composition: Thick Film; Features: -; Temperature Coefficient: -; Size / Dimension: 0.039" L x 0.020" W (1.00mm x 0.50mm); Height: 0.016" (0.40mm); Number of Terminations: 2; Packaging: Cut Tape (CT); ComponentLink1URL: http://www.yageo.com/documents/recent/PYu-RC0402_51_RoHS_L_6.pdf; ComponentLink1Description: http://www.yageo.com/documents/recent/PYu-RC0402_51_RoHS_L_6.pdf
R15 R73 R151 R152 = RC0402FR-0710KL: RES 10.0K OHM 1/16W 1% 0402 SMD; Manufacturer: Yageo; Power (Watts): 0.063W, 1/16W; .Checked PCB: used; Temperature Coefficient: ±100ppm/°C; Category: Resistors; Supplier Part Number: 311-10.0KLRCT-ND; Manufacturer Part Number: RC0402FR-0710KL; Package / Case: 0402 (1005 Metric); Price 1k [$]: 0.01421; Resistance (Ohms): 10K; Tolerance: ±1%; Value: 10k; .Checked SCH: used; Supplier: Digikey; Supplier 1: Digi-Key; Supplier Part Number 1: 311-10.0KLRCT-ND; RoHS: RoHS Compliant; Stock 1: 2916495; Pricing 1: 10=0.014, 50=0.0104, 100=0.0079, 250=0.00584, 500=0.00432, 1000=0.00288 (USD); Composition: Thick Film; Features: -; Size / Dimension: 0.039" L x 0.020" W (1.00mm x 0.50mm); Height: 0.016" (0.40mm); Number of Terminations: 2; Packaging: Cut Tape (CT); ComponentLink1URL: http://www.yageo.com/documents/recent/PYu-RC0402_51_RoHS_L_6.pdf; ComponentLink1Description: http://www.yageo.com/documents/recent/PYu-RC0402_51_RoHS_L_6.pdf
R18 = CRCW04022K10FKED: RES 2.10K OHM 1/16W 1% 0402 SMD; Manufacturer: Vishay Dale; Resistance (Ohms): 2.1k; Power (Watts): 0.063W, 1/16W; Temperature Coefficient: ±100ppm/°C; .Creator: MM; .Checked PCB: RF, used by MM; Supplier 1: Digi-Key; Manufacturer Part Number: CRCW04022K10FKED; RoHS: RoHS Compliant; Category: Resistors; Stock 1: 65680; Pricing 1: 10=0.083, 50=0.0444, 200=0.0255, 1000=0.0174 (USD); Packaging: Cut Tape (CT); Tolerance: ±1%; Composition: Thick Film; Features: Automotive AEC-Q200 Qualified; Package / Case: 0402 (1005 Metric); Supplier Device Package: 0402 (1005 Metric); Size / Dimension: 0.039" L x 0.020" W (1.00mm x 0.50mm); Height: 0.016" (0.40mm); Number of Terminations: 2; ComponentLink1URL: http://www.vishay.com/doc?20035; ComponentLink1Description: http://www.vishay.com/doc?20035; Supplier Part Number 1: 541-2.10KLCT-ND; .Checked SCH: RF, used by MM
R19 R21 R22 = CRCW0402330RFKED: RES 330 OHM 1/16W 1% 0402 SMD; Manufacturer: Vishay Dale; Resistance (Ohms): 330; Power (Watts): 0.063W, 1/16W; Temperature Coefficient: ±100ppm/°C; .Checked PCB: RF; Supplier 1: Digi-Key; Supplier Part Number 1: 541-330LCT-ND; Manufacturer Part Number: CRCW0402330RFKED; RoHS: RoHS Compliant; Category: Resistors; Stock 1: 49303; Pricing 1: 10=0.083, 50=0.0444, 200=0.0255, 1000=0.0174 (USD); Composition: Thick Film; Features: -; Tolerance: ±1%; Package / Case: 0402 (1005 Metric); Size / Dimension: 0.039" L x 0.020" W (1.00mm x 0.50mm); Height: 0.016" (0.40mm); Number of Terminations: 2; Packaging: Cut Tape (CT); ComponentLink1URL: http://www.vishay.com/doc?20035; ComponentLink1Description: http://www.vishay.com/doc?20035; .Checked SCH: RF
R20 = CRCW04022K40FKED: RES 2.40K OHM 1/16W 1% 0402 SMD; Manufacturer: Vishay Dale; Resistance (Ohms): 2.4K; Power (Watts): 0.063W, 1/16W; Temperature Coefficient: ±100ppm/°C; .Checked PCB: RF; Supplier 1: Digi-Key; Supplier Part Number 1: 541-2.40KLCT-ND; Manufacturer Part Number: CRCW04022K40FKED; RoHS: RoHS Compliant; Category: Resistors; Stock 1: 43967; Pricing 1: 10=0.083, 50=0.0444, 200=0.0255, 1000=0.0174 (USD); Composition: Thick Film; Features: -; Tolerance: ±1%; Package / Case: 0402 (1005 Metric); Size / Dimension: 0.039" L x 0.020" W (1.00mm x 0.50mm); Height: 0.016" (0.40mm); Number of Terminations: 2; Packaging: Cut Tape (CT); ComponentLink1URL: http://www.vishay.com/doc?20035; ComponentLink1Description: http://www.vishay.com/doc?20035; .Checked SCH: RF
TP1 = TP_25MILC: Test Point 25mil
U1 = TPS74801DRCR: IC REG LDO ADJ 1.5A 10SON; Manufacturer: Texas Instruments; Number of Regulators: 1; Regulator Topology: Positive Adjustable; Voltage - Input: 0.8 V ~ 5.5 V; Voltage - Output: 0.8 V ~ 3.6 V; Voltage - Dropout (Typical): 0.06V @ 1.5A; Current - Output: 1.5A (Max); Current - Limit (Min): 2A; .Creator: MM; .Checked PCB: RF, used by MM; Supplier 1: Digi-Key; Manufacturer Part Number: TPS74801DRCR; RoHS: RoHS Compliant; Category: Integrated Circuits (ICs); Stock 1: 11680; Pricing 1: 1=2.3, 10=2.074, 25=1.8576, 100=0.972, 250=0.954, 500=0.936, 750=0.918 (USD); Packaging: Cut Tape (CT); Operating Temperature: -40°C ~ 125°C; Mounting Type: Surface Mount; Package / Case: 10-VFDFN Exposed Pad; Supplier Device Package: 10-SON (3x3); ComponentLink1URL: http://www.ti.com/lit/ds/symlink/tps74801.pdf; ComponentLink1Description: http://www.ti.com/lit/ds/symlink/tps74801.pdf; Supplier Part Number 1: 296-21563-1-ND; .Checked SCH: MM

## Sheet [06] - SATA, CFAST.SchDoc
size A3; DocumentNumber: 2; SheetNumber: 6; SheetTotal: 20
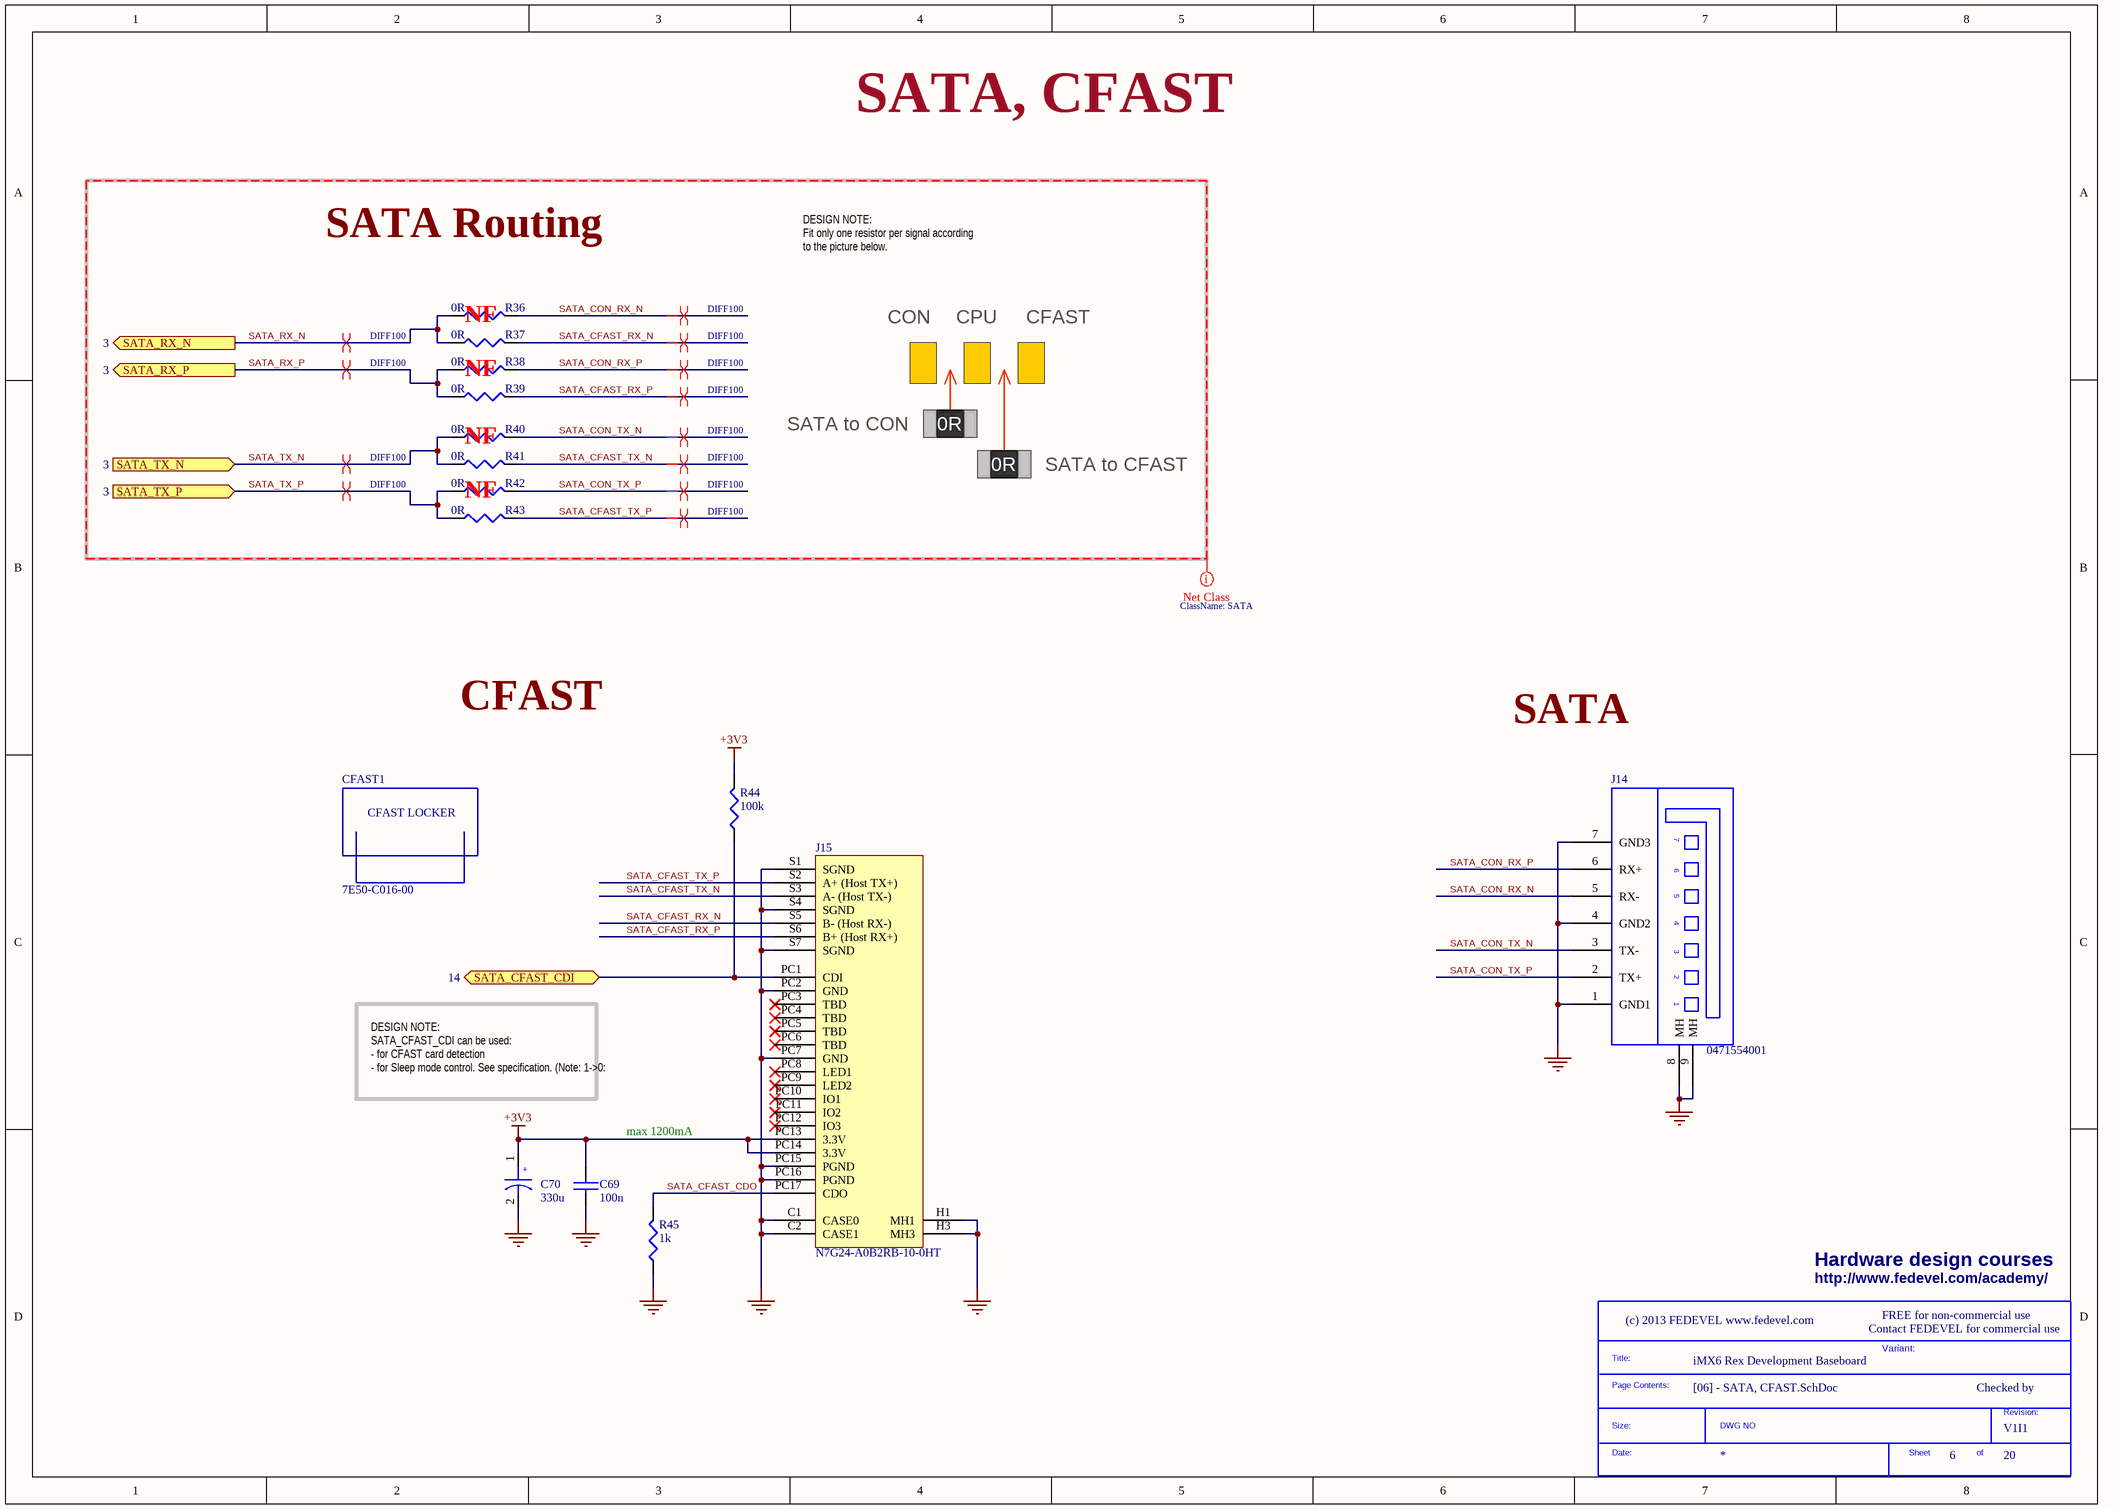
[diagram p3: [06] - SATA, CFAST.SchDoc]

### Parts
(Parts that share a designator on the sheet are numbered #1, #2 ... from top to bottom, then left to right.)
*#3  SDTitleBlock  (value not drawn)  (graphical)
C69  100n  [C0402]
C70  330u  [C2917]
CFAST1  7E50-C016-00  [CFAST_LOCKER]
J14  0471554001  [SATA_VERTICAL]
J15  N7G24-A0B2RB-10-0HT  [CFAST10]
R36  0R  [R0402]
R37  0R  [R0402]
R38  0R  [R0402]
R39  0R  [R0402]
R40  0R  [R0402]
R41  0R  [R0402]
R42  0R  [R0402]
R43  0R  [R0402]
R44  100k  [R0402]
R45  1k  [R0402]

### Blocks framed on the sheet
SATA Routing: R36-R43

### Ports
SATA_CFAST_CDI (bidir, see 14), SATA_RX_N (out, see 3), SATA_RX_P (out, see 3), SATA_TX_N (in, see 3), SATA_TX_P (in, see 3)

### Nets
+3V3: C69.1 C70.1 J15.PC13(3.3V) J15.PC14(3.3V) R44.2
GND: C69.2 C70.2 J14.1(GND1) J14.4(GND2) J14.7(GND3) J14.8(MH) J14.9(MH) J15.C1(CASE0) J15.C2(CASE1) J15.H1(MH1) J15.H3(MH3) J15.PC2(GND) J15.PC7(GND) J15.PC15(PGND) J15.PC16(PGND) J15.S1(SGND) J15.S4(SGND) J15.S7(SGND) R45.1
SATA_CFAST_CDI: J15.PC1(CDI) R44.1 ; port SATA_CFAST_CDI
SATA_CFAST_CDO: J15.PC17(CDO) R45.2
SATA_CFAST_RX_N: J15.S5(B-_(Host_RX-)) R37.2
SATA_CFAST_RX_P: J15.S6(B+_(Host_RX+)) R39.2
SATA_CFAST_TX_N: J15.S3(A-_(Host_TX-)) R41.2
SATA_CFAST_TX_P: J15.S2(A+_(Host_TX+)) R43.2
SATA_CON_RX_N: J14.5(RX-) R36.2
SATA_CON_RX_P: J14.6(RX+) R38.2
SATA_CON_TX_N: J14.3(TX-) R40.2
SATA_CON_TX_P: J14.2(TX+) R42.2
SATA_RX_N: R36.1 R37.1 ; port SATA_RX_N
SATA_RX_P: R38.1 R39.1 ; port SATA_RX_P
SATA_TX_N: R40.1 R41.1 ; port SATA_TX_N
SATA_TX_P: R42.1 R43.1 ; port SATA_TX_P

Not connected (* = marked no-connect by the designer): J15 H2 H4 H5 H6 PC3(TBD)* PC4(TBD)* PC5(TBD)* PC6(TBD)* PC8(LED1)* PC9(LED2)* PC10(IO1)* PC11(IO2)* PC12(IO3)*

### Layout directives
differential pair; net class DIFF100: SATA_CFAST_RX_N, SATA_CFAST_RX_P, SATA_CFAST_TX_N, SATA_CFAST_TX_P, SATA_CON_RX_N, SATA_CON_RX_P, SATA_CON_TX_N, SATA_CON_TX_P, SATA_RX_N, SATA_RX_P, SATA_TX_N, SATA_TX_P
net class SATA: SATA_CFAST_RX_N, SATA_CFAST_RX_P, SATA_CFAST_TX_N, SATA_CFAST_TX_P, SATA_CON_RX_N, SATA_CON_RX_P, SATA_CON_TX_N, SATA_CON_TX_P, SATA_RX_N, SATA_RX_P, SATA_TX_N, SATA_TX_P

### Notes on the sheet
- SATA, CFAST
- DESIGN NOTE:
  Fit only one resistor per signal according to the picture below.
- (near R36) NF
- (near R38) NF
- CON
- CPU
- CFAST
- (near R40) NF
- SATA to CON
- 0R
- (near R42) NF
- SATA to CFAST
- SATA
- DESIGN NOTE:
  SATA_CFAST_CDI can be used:
  - for CFAST card detection
  - for Sleep mode control. See specification. (Note: 1->0: Deasserted; 0->1 Asserted)
- max 1200mA
- Hardware design courses
- http://www.fedevel.com/academy/
- Contact FEDEVEL for commercial use
- FREE for non-commercial use
- Variant:
- Checked by
- (in symbol 7E50-C016-00) CFAST LOCKER
- (in symbol SDTitleBlock) Title:; Page Contents:; Revision:; Size:; DWG NO; Date:; Sheet; of
- (in symbol T520D337M006ATE045) +

### Library data of the parts
C69 = C1005X5R1H104K: as C6 on sheet [04] - PCIE MINI 1, PCIE; Category: Capacitors; Supplier Part Number: 445-5942-1-ND; Manufacturer Part Number: C1005X5R1H104K; Operating Temperature: -55°C ~ 85°C; Package / Case: 0402 (1005 Metric); Price 1k [$]: 0.02340; .Checked SCH: used; Voltage - Rated: 50V; Supplier: Digikey; Supplier 1: Digi-Key; Supplier Part Number 1: 445-5942-1-ND; RoHS: RoHS Compliant; Stock 1: 106926; Pricing 1: 1=0.27, 10=0.18, 100=0.072, 250=0.05176, 500=0.0369, 1000=0.027 (USD); Tolerance: ±10%; Temperature Coefficient: X5R; Mounting Type: Surface Mount, MLCC; Applications: General Purpose; Ratings: -; Size / Dimension: 0.039" L x 0.020" W (1.00mm x 0.50mm); Height - Seated (Max): -; Thickness (Max): 0.022" (0.55mm); Lead Spacing: -; Features: -; Packaging: Cut Tape (CT); Lead Style: -; ComponentLink1URL: http://www.tdk.co.jp/tefe02/e412_c.pdf; ComponentLink1Description: http://www.tdk.co.jp/tefe02/e412_c.pdf
C70 = T520D337M006ATE045: as C12 on sheet [04] - PCIE MINI 1, PCIE; Supplier 1: Digi-Key; Manufacturer Part Number: T520D337M006ATE045; RoHS: RoHS Compliant; Category: Capacitors; Stock 1: 11758; Pricing 1: 1=1.33, 10=1.05, 50=0.91, 100=0.7875, 250=0.7 (USD); Packaging: Cut Tape (CT); Voltage - Rated: 6.3V; Tolerance: ±20%; Operating Temperature: -55°C ~ 105°C; Mounting Type: Surface Mount; Package / Case: 2917 (7343 Metric); Size / Dimension: 0.287" L x 0.169" W (7.30mm x 4.30mm); Height - Seated (Max): 0.122" (3.10mm); Lead Spacing: -; Features: Polymer; Lifetime @ Temp.: -; ComponentLink1URL: http://www.kemet.com/kemet/web/homepage/kechome.nsf/file/T520%20Series/$file/KEM_T2015_T520.pdf; ComponentLink1Description: http://www.kemet.com/kemet/web/homepage/kechome.nsf/file/T520%20Series/$file/KEM_T2015_T520.pdf; Supplier Part Number 1: 399-4055-1-ND; .Checked PCB: MM
CFAST1 = 7E50-C016-00: CF CARD EJECT/LATCHING RETAINER; Manufacturer: 3M; Accessory Type: Latch Retainer; For Use With/Related Products: CompactFlash® - Type II; .Checked PCB: RF; Supplier 1: Digi-Key; Supplier Part Number 1: 3M9681-ND; Manufacturer Part Number: 7E50-C016-00; RoHS: RoHS Compliant; Category: Connectors, Interconnects; Stock 1: 1200; Pricing 1: 1=2.62, 10=2.377, 50=2.134, 100=2.037, 250=1.843, 500=1.6975, 1000=1.455, 2500=1.358, 5000=1.2901 (USD); Packaging: Tray; ComponentLink1URL: http://multimedia.3m.com/mws/mediawebserver?mwsId=SSSSSu7zK1fslxtUmYtxPY_Zev7qe17zHvTSevTSeSSSSSS--; ComponentLink1Description: http://multimedia.3m.com/mws/mediawebserver?mwsId=SSSSSu7zK1fslxtUmYtxPY_Zev7qe17zHvTSevTSeSSSSSS--; .Checked SCH: RF
J14 = 0471554001: CONN SATA HDR 7POS PCB VERT; Manufacturer: Molex Inc; Connector Style: Header, Shrouded; Number of Positions: 7; .Checked PCB: RF; Supplier 1: Digi-Key; Supplier Part Number 1: WM4059-ND; Manufacturer Part Number: 0471554001; RoHS: RoHS Compliant; Category: Connectors, Interconnects; Stock 1: 8065; Pricing 1: 1=1.37, 10=1.065, 25=0.9928, 50=0.9026, 100=0.8123, 250=0.68592, 500=0.6498, 1000=0.5776, 2500=0.48013 (USD); Connector Type: SATA; Mounting Type: Through Hole; Termination: Solder; Features: Board Lock; Contact Finish: Gold; Contact Finish Thickness: Flash; Packaging: Tray; ComponentLink1URL: http://www.molex.com/elqNow/elqRedir.htm?ref=http://www.molex.com/pdm_docs/sd/471554001_sd.pdf; ComponentLink1Description: http://www.molex.com/elqNow/elqRedir.htm?ref=http://www.molex.com/pdm_docs/sd/471554001_sd.pdf; .Checked SCH: RF
J15 = N7G24-A0B2RB-10-0HT: CFAST HEADER STANDOFF SMD R/A; Manufacturer: 3M; Card Type: CFast™ - Type I, II; Number of Positions: 24; Connector Type: Connector; Insertion, Removal Method: Push In, Pull Out; .Checked PCB: RF; Supplier 1: Digi-Key; Supplier Part Number 1: 3M9678-ND; Manufacturer Part Number: N7G24-A0B2RB-10-0HT; RoHS: RoHS Compliant; Category: Connectors, Interconnects; Stock 1: 703; Pricing 1: 1=6.58, 10=6.302, 50=5.48, 100=5.206, 250=4.658, 500=4.384, 1000=3.836, 2500=3.6442, 5000=3.562 (USD); Ejector Side: -; Mounting Type: Surface Mount, Right Angle; Features: Board Guide, Card Guide; Height Above Board: 0.303" (7.70mm); Mounting Feature: Normal, Standard - Top; Packaging: Tray; Contact Finish: Gold; Contact Finish Thickness: 30µin (0.76µm); ComponentLink1URL: http://multimedia.3m.com/mws/mediawebserver?mwsId=SSSSSu7zK1fslxtUO8_Glx2Uev7qe17zHvTSevTSeSSSSSS--; ComponentLink1Description: http://multimedia.3m.com/mws/mediawebserver?mwsId=SSSSSu7zK1fslxtUO8_Glx2Uev7qe17zHvTSevTSeSSSSSS--; .Checked SCH: RF
R36-R43 = RC0402JR-070RL: as R1 on sheet [04] - PCIE MINI 1, PCIE; Category: Resistors; Manufacturer Part Number: RC0402JR-070RL; Package / Case: 0402 (1005 Metric); Price 1k [$]: 0.01389; Value: 0R; .Checked SCH: used; Supplier Part Number: 311-0.0JRCT-ND; Supplier: Digikey; Supplier 1: Digi-Key; Supplier Part Number 1: 311-0.0JRCT-ND; RoHS: RoHS Compliant; Stock 1: 1106330; Pricing 1: 10=0.012, 50=0.009, 100=0.0069, 250=0.00512, 500=0.0038, 1000=0.00253 (USD); Composition: Thick Film; Features: -; Temperature Coefficient: -; Size / Dimension: 0.039" L x 0.020" W (1.00mm x 0.50mm); Height: 0.016" (0.40mm); Number of Terminations: 2; Packaging: Cut Tape (CT); ComponentLink1URL: http://www.yageo.com/documents/recent/PYu-RC0402_51_RoHS_L_6.pdf; ComponentLink1Description: http://www.yageo.com/documents/recent/PYu-RC0402_51_RoHS_L_6.pdf
R44 = RMCF0402FT100K: RES 100K OHM 1/16W 1% 0402 SMD; Manufacturer: Stackpole Electronics Inc; Power (Watts): 0.063W, 1/16W; .Checked PCB: used; Temperature Coefficient: ±100ppm/°C; Category: Resistors; Supplier Part Number: RMCF0402FT100KCT-ND; Manufacturer Part Number: RMCF0402FT100K; Package / Case: 0402 (1005 Metric); Price 1k [$]: 0.00384; Resistance (Ohms): 100K; Tolerance: ±1%; Value: 100k; .Checked SCH: used; Supplier: Digikey; Supplier 1: Digi-Key; Supplier Part Number 1: RMCF0402FT100KCT-ND; RoHS: RoHS Compliant; Stock 1: 95; Pricing 1: 1=0.04, 10=0.025, 50=0.0138, 100=0.0105, 250=0.0078, 500=0.00576, 1000=0.00384 (USD); Composition: Thick Film; Features: -; Size / Dimension: 0.039" L x 0.020" W (1.00mm x 0.50mm); Height: 0.016" (0.40mm); Number of Terminations: 2; Packaging: Cut Tape (CT); ComponentLink1URL: http://www.seielect.com/Catalog/SEI-RMCF.pdf; ComponentLink1Description: http://www.seielect.com/Catalog/SEI-RMCF.pdf
R45 = RC0402FR-071KL: RES 1.00K OHM 1/16W 1% 0402 SMD; Manufacturer: Yageo; Power (Watts): 0.063W, 1/16W; .Checked PCB: used; Temperature Coefficient: ±100ppm/°C; Category: Resistors; Supplier Part Number: 311-1.00KLRCT-ND; Manufacturer Part Number: RC0402FR-071KL; Package / Case: 0402 (1005 Metric); Price 1k [$]: 0.01421; Resistance (Ohms): 1K; Tolerance: ±1%; Value: 1k; .Checked SCH: used; Supplier: Digikey; Supplier 1: Digi-Key; Supplier Part Number 1: 311-1.00KLRCT-ND; RoHS: RoHS Compliant; Stock 1: 1753477; Pricing 1: 10=0.014, 50=0.0104, 100=0.0079, 250=0.00584, 500=0.00432, 1000=0.00288 (USD); Composition: Thick Film; Features: -; Size / Dimension: 0.039" L x 0.020" W (1.00mm x 0.50mm); Height: 0.016" (0.40mm); Number of Terminations: 2; Packaging: Cut Tape (CT); ComponentLink1URL: http://www.yageo.com/documents/recent/PYu-RC0402_51_RoHS_L_6.pdf; ComponentLink1Description: http://www.yageo.com/documents/recent/PYu-RC0402_51_RoHS_L_6.pdf